# Altium schematic sheet Boost_Converter.SchDoc
size A3; DocumentNumber: 8; SheetNumber: 8; SheetTotal: 11
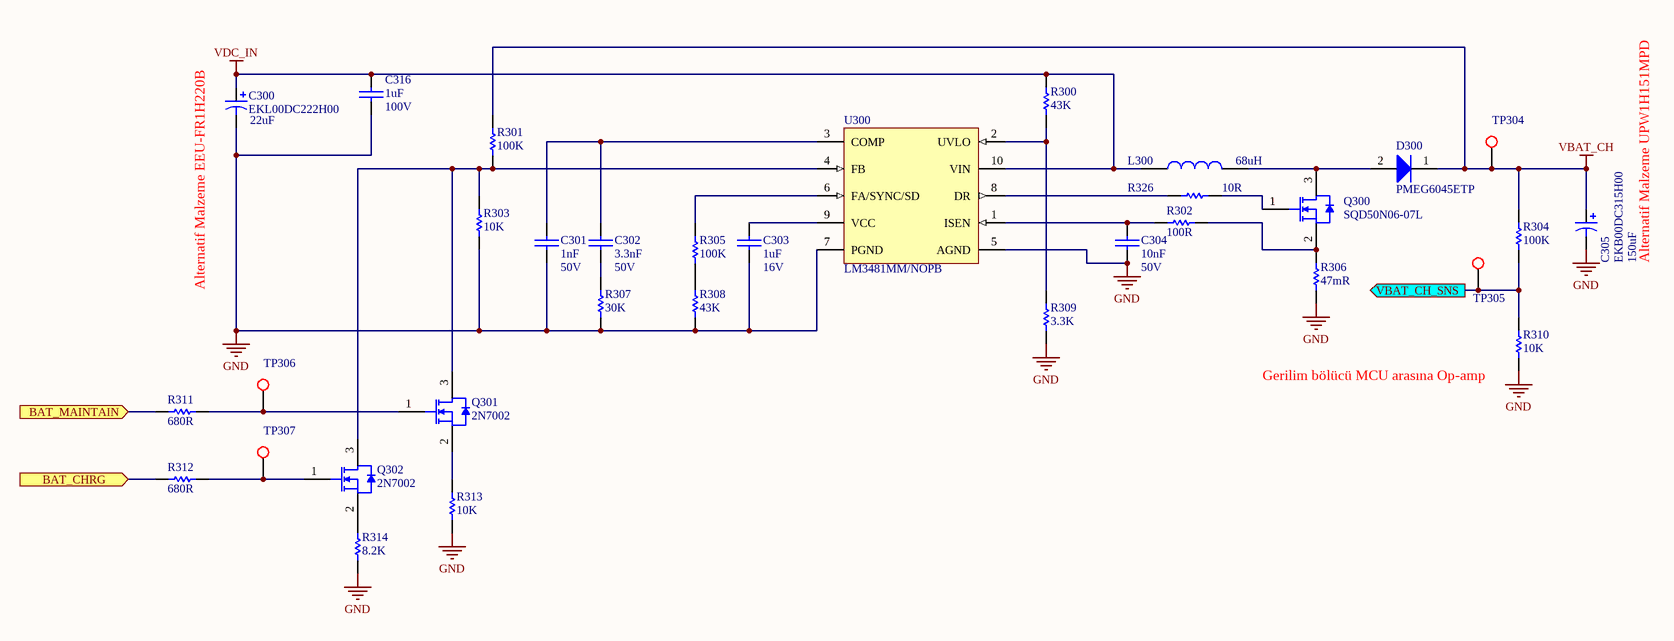
[diagram p0: Boost_Converter.SchDoc]

## Parts
C300  EKL00DC222H00  value 22uF  [CAPPR5-10X12.5]
C301  Operating Voltage: 50V  [CAPC1005X06N]  (hidden comment: 1nF)
C302  Operating Voltage: 50V  [CAPC1005X06N]  (hidden comment: 3.3nF)
C303  Operating Voltage: 16V  [CAPC2012X14N]  (hidden comment: 1uF)
C304  Operating Voltage: 50V  [CAPC1005X06N]  (hidden comment: 10nF)
C305  EKB00DC315H00  value 150uF  [CAPPR5-10X12.5]
C316  Operating Voltage: 100V  [CAPC3216X09N]  (hidden comment: 1uF)
D300  PMEG6045ETP  [DIOM3825X11N]
L300  68uH  [INDM120120X100N]
Q300  SQD50N06-07L  [TO228P970-3N]
Q301  2N7002  [SOT90P247X115-3N]
Q302  2N7002  [SOT90P247X115-3N]
R300  43K  [RESC1005X04N]
R301  100K  [RESC1005X04N]
R302  100R  [RESC1005X04N]
R303  10K  [RESC1005X04N]
R304  100K  [RESC1005X04N]
R305  100K  [RESC1005X04N]
R306  47mR  [RESC3216X08N]
R307  30K  [RESC1005X04N]
R308  43K  [RESC1005X04N]
R309  3.3K  [RESC1005X04N]
R310  10K  [RESC1005X04N]
R311  680R  [RESC1005X04N]
R312  680R  [RESC1005X04N]
R313  10K  [RESC1005X04N]
R314  8.2K  [RESC1005X04N]
R326  10R  [RESC1005X04N]
TP304  AEMT-C00S-1000-0000  [TP100]  (value not drawn)
TP305  AEMT-C00S-1000-0000  [TP100]  (value not drawn)
TP306  AEMT-C00S-1000-0000  [TP100]  (value not drawn)
TP307  AEMT-C00S-1000-0000  [TP100]  (value not drawn)
U300  LM3481MM/NOPB  [MUB10A_N]

## Ports
BAT_CHRG (in), BAT_MAINTAIN (in), VBAT_CH_SNS (out)

## Nets
GND: C300.2 C301.1 C303.1 C304.1 C305.2 C316.1 R303.1 R306.2 R307.1 R308.1 R309.1 R310.1 R313.1 R314.1 U300.5(AGND) U300.7(PGND)
VBAT_CH: C305.1 D300.1(K) R301.2 R304.2 TP304.1
VDC_IN: C300.1 C316.2 L300.1 R300.2 U300.10(VIN)
BAT_CHRG: R312.2 ; port BAT_CHRG
BAT_MAINTAIN: R311.2 ; port BAT_MAINTAIN
VBAT_CH_SNS: R304.1 R310.2 TP305.1 ; port VBAT_CH_SNS
NetC301_2: C301.2 C302.2 U300.3(COMP)
NetC302_1: C302.1 R307.2
NetC303_2: C303.2 U300.9(VCC)
NetC304_2: C304.2 R302.1 U300.1(ISEN)
NetD300_2: D300.2(A) L300.2 Q300.3(Drain)
NetQ300_1: Q300.1(Gate) R326.2
NetQ300_2: Q300.2(Source) R302.2 R306.1
NetQ301_1: Q301.1(Gate) R311.1 TP306.1
NetQ301_2: Q301.2(Source) R313.2
NetQ301_3: Q301.3(Drain) Q302.3(Drain) R301.1 R303.2 U300.4(FB)
NetQ302_1: Q302.1(Gate) R312.1 TP307.1
NetQ302_2: Q302.2(Source) R314.2
NetR300_1: R300.1 R309.2 U300.2(UVLO)
NetR305_1: R305.1 R308.2
NetR305_2: R305.2 U300.6(FA/SYNC/SD)
NetR326_1: R326.1 U300.8(DR)

## Notes on the sheet
- (near C300) Alternatif Malzeme EEU-FR1H220B
- (near C305) Alternatif Malzeme UPW1H151MPD
- (near R310) Gerilim bölücü MCU arasına Op-amp
- Title
- Size:
- Date:
- A3
- Number:
- Time:
- Revision:
- Sheet
- of
- File:

## Library data of the parts
C300 = EKL00DC222H00: Aluminum Electrolytic Capacitor, Radial Style with Long Leads: 22uF, 50V; Note: Refer to Manufacturer's Data Sheets for other lead formations; DrillSize: Nominal, Rounded To The Nearest 0.1mm; Published: 19-Mar-2004; DatasheetDocument: 12-Jan-2000; PackageReference: CAPPR5-10X12.5; Publisher: Altium Limited; ComponentLink1Description: Manufacturer Link; ComponentLink1URL: http://www.vishay.com/; ComponentLink2Description: Datasheet; ComponentLink2URL: http://www.vishay.com/docs/25010/ekl.pdf
C301 = ACC0-0100-S272-0000: CAP, CER, C0G, 1nF, %5, 50V, 0402; Manufacturer: Murata; Manufacturer Part Number: GRM1555C1H102JA01D; CR: 000049; Requested by: MU; Lead Finish: Pb Free; Material: Ceramic, C0G; Definition Date: 14.08.2012; Revision Date: *; Price: *; Supplier: *; Supplier Part Number: *; DS: 000049; Operating Temp: -55 to 125 C; Storage Temp: -55 to 125 C; Status: Active; Package Reference: EIA 0402, Metric 1005; Component Type: Capacitor; Footprint Type: SMD; Published by: MU; ESR: *; FR: *; Value: 1nF
C302 = ACC7-0330-S271-0000: CAP, CER, X7R, 3.3nF, %10, 50V, 0402; Manufacturer: Murata; Manufacturer Part Number: GRM155R71H332KA01D; CR: 000049; Requested by: MU; Lead Finish: Pb Free; Material: Ceramic, X7R; Definition Date: 14.08.2012; Revision Date: *; Price: *; Supplier: *; Supplier Part Number: *; DS: 000049; Operating Temp: -55 to 125 C; Storage Temp: -55 to 125 C; Status: Active; Package Reference: EIA 0402, Metric 1005; Component Type: Capacitor; Footprint Type: SMD; Published by: MU; ESR: *; FR: *; Value: 3.3nF
C303 = ACC7-3100-S441-0000: CAP, CER, X7R, 1uF, %10, 16V, 0805; Manufacturer: Murata; Manufacturer Part Number: GRM21BR71C105KA01L; CR: 000049; Requested by: MU; Lead Finish: Pb Free; Material: Ceramic, X7R; Definition Date: 14.08.2012; Revision Date: *; Price: *; Supplier: *; Supplier Part Number: *; DS: 000049; Operating Temp: -55 to 125 C; Storage Temp: -55 to 125 C; Status: Active; Package Reference: EIA 0805, Metric 2012; Component Type: Capacitor; Footprint Type: SMD; Published by: MU; ESR: *; FR: *; Value: 1uF
C304 = ACC7-1100-S271-0000: CAP, CER, X7R, 10nF, %10, 50V, 0402; Manufacturer: Murata; Manufacturer Part Number: GRM155R71H103KA88D; CR: 000049; Requested by: MU; Lead Finish: Pb Free; Material: Ceramic, X7R; Definition Date: 14.08.2012; Revision Date: *; Price: *; Supplier: *; Supplier Part Number: *; DS: 000049; Operating Temp: -55 to 125 C; Storage Temp: -55 to 125 C; Status: Active; Package Reference: EIA 0402, Metric 1005; Component Type: Capacitor; Footprint Type: SMD; Published by: MU; ESR: *; FR: *; Value: 10nF
C305 = EKB00DC315H00: Aluminum Electrolytic Capacitor, Radial Style with Long Leads: 150uF, 50V; Note: Refer to Manufacturer's Data Sheets for other lead formations; DrillSize: Nominal, Rounded To The Nearest 0.1mm; Published: 19-Mar-2004; DatasheetDocument: 21-Feb-2001; PackageReference: CAPPR5-10X12.5; Publisher: Altium Limited; ComponentLink1Description: Manufacturer Link; ComponentLink1URL: http://www.vishay.com/; ComponentLink2Description: Datasheet; ComponentLink2URL: http://www.vishay.com/docs/25013/ekb.pdf
C316 = ACC7-3100-S691-0000: CAP, CER, X7R, 1uF, %10, 100V, 1206; Manufacturer: Murata; Manufacturer Part Number: GRM31CR72A105KA01L; CR: 344; Requested by: NK; DS: 00049; Lead Finish: Pb Free; Published by: IS; Material: Ceramic, X7R; Definition Date: 13.02.2014; Revision Date: *; Price: *; Supplier: *; Supplier Part Number: *; Operating Temp: -55 to 125 C; Storage Temp: -55 to 125 C; Status: Active; Package Reference: EIA 1206, Metric 3216; Component Type: Capacitor; Footprint Type: SMD; ESR: *; FR: *; Value: 1uF
D300 = AS15-945M-SI10-0000: Diode, Schottky, 0.53V @4.5A, 60V, SOD-128; Manufacturer: NXP; Lead Finish: Pb Free; Published by: NK; Price: *; Manufacturer Part Number: PMEG6045ETP; CR: -; DS: -; Definition Date: 25.07.2015; Footprint Type: SMD; JEDEC Code: *; Operating Temp: -55 to 175 C; Package Reference: SOD128; Requested by: NK; Revision Date: *; Status: Active; Storage Temp: -65to 175 C; Supplier: *; Supplier Part Number: *; Component Type: DIODE; Forward Voltage: *; Reverse Voltage: *; Value: *
L300 = AL17-1680-SN35-3300: Inductor, Power, 68uH, 3A, 0.1ohm, SMD; Manufacturer: Bourns; Manufacturer Part Number: SRR1210-680M; DCR(max): 0.102; Published By: NK; CR: -; DS: -; Component Type: Power Inductor; Definition Date: 26.07.2015; Footprint Type: SMD; Height: 10; Operating Temp: -40, +125; Rated Current: 3A; Requested By: NK; Value: 68uH
Q300 = AS26-A50M-SI40-0000: Transistor, MOSFET, N, 60V, 50A, 7.6mR, SQD50N06-07L, TO-252; Manufacturer Part Number: SQD50N06-07L-GE3; Manufacturer: VISHAY; CR: 000207/85; DS: 000207; Lead Finish: Pb Free; Published by: MU; Requested by: MAY; Vgs(max): +-20V; Price: *; Definition Date: 18.02.2013; Footprint Type: SMD; JEDEC Code: TO-252; Operating Temp: -55 to 175 C; Package Reference: TO-252; Revision Date: *; Status: Active; Storage Temp: -55 to 175 C; Supplier: *; Supplier Part Number: *; Component Type: TRS/MOSFET; Vds(max): 60V; Id: 50A; Value: SQD50N06-07L
Q301 Q302 = AS26-810M-SI20-0000: Transistor, MOSFET, N, 60V, 115mA, 2N7002, SOT23; Manufacturer: Fairchild; CR: 000338; DS: 000368; JEDEC Code: TO-236AB; Lead Finish: Pb Free; Published by: MU; Requested by: MAY; Vgs(max): +-20V; Price: *; Manufacturer Part Number: 2N7002; Definition Date: 27.01.2014; Footprint Type: SMD; Operating Temp: -55 to 150 C; Package Reference: SOT23; Revision Date: *; Status: Active; Storage Temp: -55 to 150 C; Supplier: *; Supplier Part Number: *; Component Type: TRS/MOSFET; Vds(max): 60V; Id: 115mA; Value: 2N7002
R300 R308 = AR19-4430-S2B2-0000: RES, E24, Thick Film, SMD, 43K, 1%, 0.1W, 0402; Manufacturer: Panasonic; Manufacturer Part Number: ERJ-2RKF4302X; CR: DS00073; Requested by: MU; Lead Finish: Pb Free; Max. Operating Voltage: 50V; Definition Date: 16.08.2012; Revision Date: *; Price: *; Supplier: *; Supplier Part Number: *; DS: DS00073; Operating Temp: -55 to 155 C; Storage Temp: -55 to 155 C; Status: Active; Package Reference: EIA 0402, Metric 1005; Component Type: Resistor; Footprint Type: SMD; Published by: MU; JEDEC Code: *; Material: Thick Film; ESR: *; FR: *; Power Rating: 0.1W; Value: 43K
R301 R304 R305 = AR19-5100-S2B2-0000: RES, E24, Thick Film, SMD, 100K, 1%, 0.1W, 0402; Manufacturer: Panasonic; Manufacturer Part Number: ERJ-2RKF1003X; CR: DS00073; Requested by: MU; Lead Finish: Pb Free; Max. Operating Voltage: 50V; Definition Date: 16.08.2012; Revision Date: *; Price: *; Supplier: *; Supplier Part Number: *; DS: DS00073; Operating Temp: -55 to 155 C; Storage Temp: -55 to 155 C; Status: Active; Package Reference: EIA 0402, Metric 1005; Component Type: Resistor; Footprint Type: SMD; Published by: MU; JEDEC Code: *; Material: Thick Film; ESR: *; FR: *; Power Rating: 0.1W; Value: 100K
R302 = AR19-2100-S2B2-0000: RES, E24, Thick Film, SMD, 100R, 1%, 0.1W, 0402; Manufacturer: Panasonic; Manufacturer Part Number: ERJ-2RKF1000X; CR: DS00073; Requested by: MU; Lead Finish: Pb Free; Max. Operating Voltage: 50V; Definition Date: 16.08.2012; Revision Date: *; Price: *; Supplier: *; Supplier Part Number: *; DS: DS00073; Operating Temp: -55 to 155 C; Storage Temp: -55 to 155 C; Status: Active; Package Reference: EIA 0402, Metric 1005; Component Type: Resistor; Footprint Type: SMD; Published by: MU; JEDEC Code: *; Material: Thick Film; ESR: *; FR: *; Power Rating: 0.1W; Value: 100R
R303 R310 R313 = AR19-4100-S2B2-0000: RES, E24, Thick Film, SMD, 10K, 1%, 0.1W, 0402; Manufacturer: Panasonic; Manufacturer Part Number: ERJ-2RKF1002X; CR: DS00073; Requested by: MU; Lead Finish: Pb Free; Max. Operating Voltage: 50V; Definition Date: 16.08.2012; Revision Date: *; Price: *; Supplier: *; Supplier Part Number: *; DS: DS00073; Operating Temp: -55 to 155 C; Storage Temp: -55 to 155 C; Status: Active; Package Reference: EIA 0402, Metric 1005; Component Type: Resistor; Footprint Type: SMD; Published by: MU; JEDEC Code: *; Material: Thick Film; ESR: *; FR: *; Power Rating: 0.1W; Value: 10K
R306 = AR19-Y470-S5D2-0000: RES, Thick Film, SMD, 47mR, 1%, 1W, 1206; Manufacturer: Panasonic; Manufacturer Part Number: ERJ-8BWFR047V; CR: 000078/95; Requested by: MU; DS: 000078; Lead Finish: Pb Free; Max. Operating Voltage: 0.40; Definition Date: 19.02.2013; Revision Date: *; Price: *; Supplier: *; Supplier Part Number: *; Operating Temp: -55 to 155 C; Storage Temp: -55 to 155 C; Status: Active; Package Reference: EIA 1206, Metric 3216; Component Type: Resistor; Footprint Type: SMD; Published by: MU; JEDEC Code: *; Material: Thick Film; ESR: *; FR: *; Power Rating: 1W; Value: 47mR
R307 = AR19-4300-S2B2-0000: RES, E24, Thick Film, SMD, 30K, 1%, 0.1W, 0402; Manufacturer: Panasonic; Manufacturer Part Number: ERJ-2RKF3002X; CR: DS00073; Requested by: MU; Lead Finish: Pb Free; Max. Operating Voltage: 50V; Definition Date: 16.08.2012; Revision Date: *; Price: *; Supplier: *; Supplier Part Number: *; DS: DS00073; Operating Temp: -55 to 155 C; Storage Temp: -55 to 155 C; Status: Active; Package Reference: EIA 0402, Metric 1005; Component Type: Resistor; Footprint Type: SMD; Published by: MU; JEDEC Code: *; Material: Thick Film; ESR: *; FR: *; Power Rating: 0.1W; Value: 30K
R309 = AR19-3330-S2B2-0000: RES, E24, Thick Film, SMD, 3.3K, 1%, 0.1W, 0402; Manufacturer: Panasonic; Manufacturer Part Number: ERJ-2RKF3301X; CR: DS00073; Requested by: MU; Lead Finish: Pb Free; Max. Operating Voltage: 50V; Definition Date: 16.08.2012; Revision Date: *; Price: *; Supplier: *; Supplier Part Number: *; DS: DS00073; Operating Temp: -55 to 155 C; Storage Temp: -55 to 155 C; Status: Active; Package Reference: EIA 0402, Metric 1005; Component Type: Resistor; Footprint Type: SMD; Published by: MU; JEDEC Code: *; Material: Thick Film; ESR: *; FR: *; Power Rating: 0.1W; Value: 3.3K
R311 R312 = AR19-2680-S2B2-0000: RES, E24, Thick Film, SMD, 680R, 1%, 0.1W, 0402; Manufacturer: Panasonic; Manufacturer Part Number: ERJ-2RKF6800X; CR: DS00073; Requested by: MU; Lead Finish: Pb Free; Max. Operating Voltage: 50V; Definition Date: 16.08.2012; Revision Date: *; Price: *; Supplier: *; Supplier Part Number: *; DS: DS00073; Operating Temp: -55 to 155 C; Storage Temp: -55 to 155 C; Status: Active; Package Reference: EIA 0402, Metric 1005; Component Type: Resistor; Footprint Type: SMD; Published by: MU; JEDEC Code: *; Material: Thick Film; ESR: *; FR: *; Power Rating: 0.1W; Value: 680R
R314 = AR19-3820-S2B2-0000: RES, E24, Thick Film, SMD, 8.2K, 1%, 0.1W, 0402; Manufacturer: Panasonic; Manufacturer Part Number: ERJ-2RKF8201X; CR: DS00073; Requested by: MU; Lead Finish: Pb Free; Max. Operating Voltage: 50V; Definition Date: 16.08.2012; Revision Date: *; Price: *; Supplier: *; Supplier Part Number: *; DS: DS00073; Operating Temp: -55 to 155 C; Storage Temp: -55 to 155 C; Status: Active; Package Reference: EIA 0402, Metric 1005; Component Type: Resistor; Footprint Type: SMD; Published by: MU; JEDEC Code: *; Material: Thick Film; ESR: *; FR: *; Power Rating: 0.1W; Value: 8.2K
R326 = AR19-1100-S2B2-0000: RES, E24, Thick Film, SMD, 10R, 1%, 0.1W, 0402; Manufacturer: Panasonic; Manufacturer Part Number: ERJ-2RKF10R0X; CR: DS00073; Requested by: MU; Lead Finish: Pb Free; Max. Operating Voltage: 50V; Definition Date: 16.08.2012; Revision Date: *; Price: *; Supplier: *; Supplier Part Number: *; DS: DS00073; Operating Temp: -55 to 155 C; Storage Temp: -55 to 155 C; Status: Active; Package Reference: EIA 0402, Metric 1005; Component Type: Resistor; Footprint Type: SMD; Published by: MU; JEDEC Code: *; Material: Thick Film; ESR: *; FR: *; Power Rating: 0.1W; Value: 10R
TP304-TP307 = AEMT-C00S-1000-0000: Test Point, Circular, 1mm; Text: TEST_POINT
U300 = LM3481MM/NOPB: High Efficiency Low-Side N-Channel Controller for Switching Regulators, 10-pin MSOP, Pb-Free; Manufacturer: National Semiconductor; PackageTopMarking: ZXTT*SJPB; PowerWise: N; CompType: MiscPower; High-Reliability: Y; DatasheetVersion: Mar-2011; PackageVersion: revB, Jul-2003; PackageReference: MUB10A; PackageDescription: Mini-SO, Molded, .118 x .118 x .034in Body, 10 Lead, .0197in Pitch; PartNumber: LM3481MM/NOPB; RoHS: Y; PinCount: 10; Code_JEDEC: MO-187-BA; ComponentLink1Description: Manufacturer URL; ComponentLink1URL: http://www.national.com/; ComponentLink2Description: LM3481 Datasheet; ComponentLink2URL: http://www.national.com/ds/LM/LM3481.pdf; ComponentLink3Description: LM3481 Web Page; ComponentLink3URL: http://www.national.com/pf/LM/LM3481.html; ComponentLink4Description: MUB10A Package Page; ComponentLink4URL: http://www.national.com/packaging/folders/mub10a.html